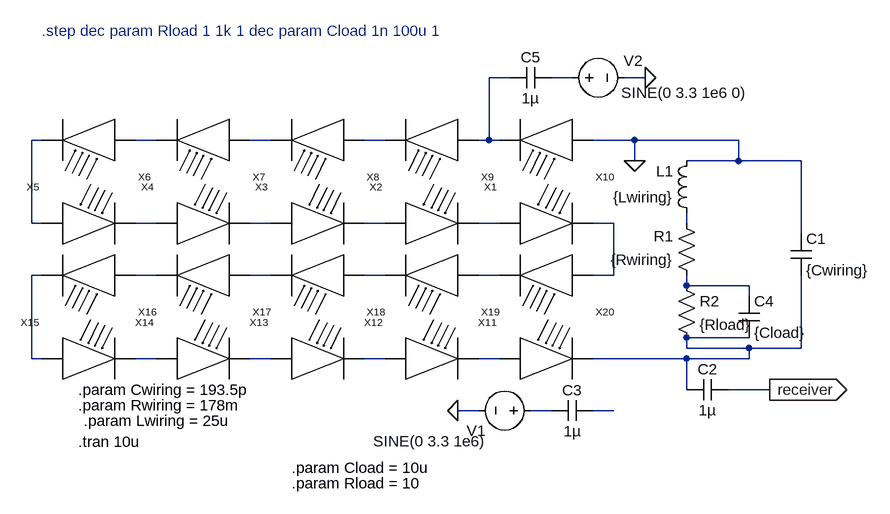
[diagram p0: schematic capacitive.asc]
capacitive.asc, the LTspice schematic file:
Version 4
SHEET 1 1588 680
WIRE 48 -400 16 -400
WIRE 144 -400 112 -400
WIRE 256 -400 224 -400
WIRE -672 -304 -688 -304
WIRE -496 -304 -528 -304
WIRE -320 -304 -352 -304
WIRE -144 -304 -176 -304
WIRE 16 -304 16 -400
WIRE 16 -304 0 -304
WIRE 32 -304 16 -304
WIRE 240 -304 176 -304
WIRE 400 -304 240 -304
WIRE 240 -272 240 -304
WIRE 400 -272 400 -304
WIRE 400 -272 320 -272
WIRE 496 -272 400 -272
WIRE -688 -176 -688 -304
WIRE -672 -176 -688 -176
WIRE -496 -176 -528 -176
WIRE -320 -176 -352 -176
WIRE -144 -176 -176 -176
WIRE 32 -176 0 -176
WIRE 208 -176 176 -176
WIRE 320 -176 320 -192
WIRE 496 -160 496 -272
WIRE -672 -96 -688 -96
WIRE -496 -96 -528 -96
WIRE -320 -96 -352 -96
WIRE -144 -96 -176 -96
WIRE 32 -96 0 -96
WIRE 208 -96 208 -176
WIRE 208 -96 176 -96
WIRE 320 -80 320 -96
WIRE 416 -80 320 -80
WIRE 416 -64 416 -80
WIRE 416 0 320 0
WIRE 320 16 320 0
WIRE 416 16 320 16
WIRE 496 16 496 -96
WIRE 496 16 416 16
WIRE -688 32 -688 -96
WIRE -672 32 -688 32
WIRE -496 32 -528 32
WIRE -320 32 -352 32
WIRE -144 32 -176 32
WIRE 32 32 0 32
WIRE 320 32 176 32
WIRE 416 32 416 16
WIRE 416 32 320 32
WIRE 320 80 320 32
WIRE 448 80 384 80
WIRE 0 112 -32 112
WIRE 112 112 80 112
WIRE 208 112 176 112
FLAG 448 80 receiver
IOPIN 448 80 Out
FLAG -32 112 0
FLAG 240 -272 0
FLAG 256 -400 0
SYMBOL cap 480 -160 R0
SYMATTR InstName C1
SYMATTR Value {Cwiring}
SYMBOL ind 336 -176 R180
WINDOW 0 36 80 Left 2
WINDOW 3 36 40 Left 2
SYMATTR InstName L1
SYMATTR Value {Lwiring}
SYMBOL cap 320 96 R270
WINDOW 0 32 32 VTop 2
WINDOW 3 0 32 VBottom 2
SYMATTR InstName C2
SYMATTR Value 1µ
SYMBOL cap 112 128 R270
WINDOW 0 32 32 VTop 2
WINDOW 3 0 32 VBottom 2
SYMATTR InstName C3
SYMATTR Value 1µ
SYMBOL voltage 96 112 R90
WINDOW 123 0 0 Left 2
WINDOW 39 63 85 VRight 2
WINDOW 0 31 85 VRight 2
WINDOW 3 47 85 VRight 2
SYMATTR InstName V1
SYMATTR Value SINE(0 3.3 1e6)
SYMBOL res 336 -80 R180
WINDOW 0 36 76 Left 2
WINDOW 3 36 40 Left 2
SYMATTR InstName R1
SYMATTR Value {Rwiring}
SYMBOL res 304 -96 R0
SYMATTR InstName R2
SYMATTR Value {Rload}
SYMBOL cap 400 -64 R0
SYMATTR InstName C4
SYMATTR Value {Cload}
SYMBOL jacModule 112 -304 R180
SYMATTR InstName X1
SYMBOL jacModule -64 -304 R180
SYMATTR InstName X2
SYMBOL jacModule -240 -304 R180
SYMATTR InstName X3
SYMBOL jacModule -416 -304 R180
SYMATTR InstName X4
SYMBOL jacModule -592 -304 R180
SYMATTR InstName X5
SYMBOL jacModule -608 -176 R0
SYMATTR InstName X6
SYMBOL jacModule -432 -176 R0
SYMATTR InstName X7
SYMBOL jacModule -256 -176 R0
SYMATTR InstName X8
SYMBOL jacModule -80 -176 R0
SYMATTR InstName X9
SYMBOL jacModule 96 -176 R0
SYMATTR InstName X10
SYMBOL jacModule 112 -96 R180
SYMATTR InstName X11
SYMBOL jacModule -64 -96 R180
SYMATTR InstName X12
SYMBOL jacModule -240 -96 R180
SYMATTR InstName X13
SYMBOL jacModule -416 -96 R180
SYMATTR InstName X14
SYMBOL jacModule -592 -96 R180
SYMATTR InstName X15
SYMBOL jacModule -608 32 R0
SYMATTR InstName X16
SYMBOL jacModule -432 32 R0
SYMATTR InstName X17
SYMBOL jacModule -256 32 R0
SYMATTR InstName X18
SYMBOL jacModule -80 32 R0
SYMATTR InstName X19
SYMBOL jacModule 96 32 R0
SYMATTR InstName X20
SYMBOL cap 112 -416 R90
WINDOW 0 0 32 VBottom 2
WINDOW 3 32 32 VTop 2
SYMATTR InstName C5
SYMATTR Value 1µ
SYMBOL voltage 128 -400 R270
WINDOW 123 0 0 Left 2
WINDOW 39 15 85 VRight 2
WINDOW 0 26 95 VRight 2
WINDOW 3 -23 91 VRight 2
SYMATTR InstName V2
SYMATTR Value SINE(0 3.3 1e6 0)
TEXT -616 160 Left 2 !.tran 10u
TEXT -288 224 Left 2 !.param Rload = 10
TEXT -288 200 Left 2 !.param Cload = 10u
TEXT -616 80 Left 2 !.param Cwiring = 193.5p
TEXT -616 104 Left 2 !.param Rwiring = 178m
TEXT -608 128 Left 2 !.param Lwiring = 25u
TEXT -672 -472 Left 2 ;.step dec param Rload 1 1k 1 dec param Cload 1n 100u 1

The netlist it stands for:
* capacitive.asc
C1 0 N019 {Cwiring}
L1 N012 0 {Lwiring}
C2 N019 receiver 1µ
C3 N024 N025 1µ
V1 N024 0 SINE(0 3.3 1e6)
R1 N018 N012 {Rwiring}
R2 N018 N019 {Rload}
C4 N018 N019 {Cload}
XX1 0 N001 jacModule  ; pins modIN modOUT
XX2 N001 N006 jacModule  ; pins modIN modOUT
XX3 N006 N005 jacModule  ; pins modIN modOUT
XX4 N005 N004 jacModule  ; pins modIN modOUT
XX5 N004 N003 jacModule  ; pins modIN modOUT
XX6 N003 N007 jacModule  ; pins modIN modOUT
XX7 N007 N008 jacModule  ; pins modIN modOUT
XX8 N008 N009 jacModule  ; pins modIN modOUT
XX9 N009 N010 jacModule  ; pins modIN modOUT
XX10 N010 N011 jacModule  ; pins modIN modOUT
XX11 N011 N017 jacModule  ; pins modIN modOUT
XX12 N017 N016 jacModule  ; pins modIN modOUT
XX13 N016 N015 jacModule  ; pins modIN modOUT
XX14 N015 N014 jacModule  ; pins modIN modOUT
XX15 N014 N013 jacModule  ; pins modIN modOUT
XX16 N013 N020 jacModule  ; pins modIN modOUT
XX17 N020 N021 jacModule  ; pins modIN modOUT
XX18 N021 N022 jacModule  ; pins modIN modOUT
XX19 N022 N023 jacModule  ; pins modIN modOUT
XX20 N023 N019 jacModule  ; pins modIN modOUT
C5 N002 N001 1µ
V2 N002 0 SINE(0 3.3 1e6 0)
.tran 10u
.param Rload = 10
.param Cload = 10u
.param Cwiring = 193.5p
.param Rwiring = 178m
.param Lwiring = 25u
* .step dec param Rload 1 1k 1 dec param Cload 1n 100u 1
.backanno
.end